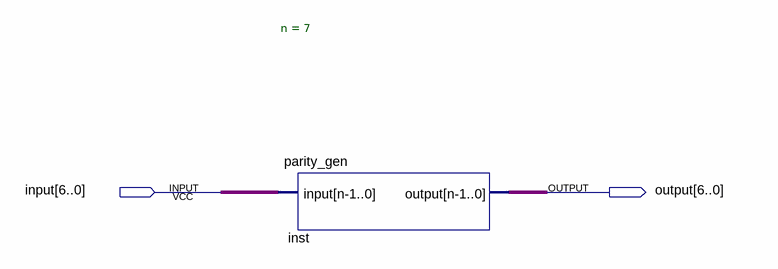
[diagram p0: schematic sheet]
// Quartus schematic Block1.bdf as structural Verilog: 1 symbols, 2 pins
module Block1 (
  input  [6:0] \input ,
  output [6:0] \output 
);

  parity_gen #(.n(7)) inst (.\input (\input ), .\output (\output ));
endmodule
